# EAGLE design Moty Light (EAGLE 7.6.0)
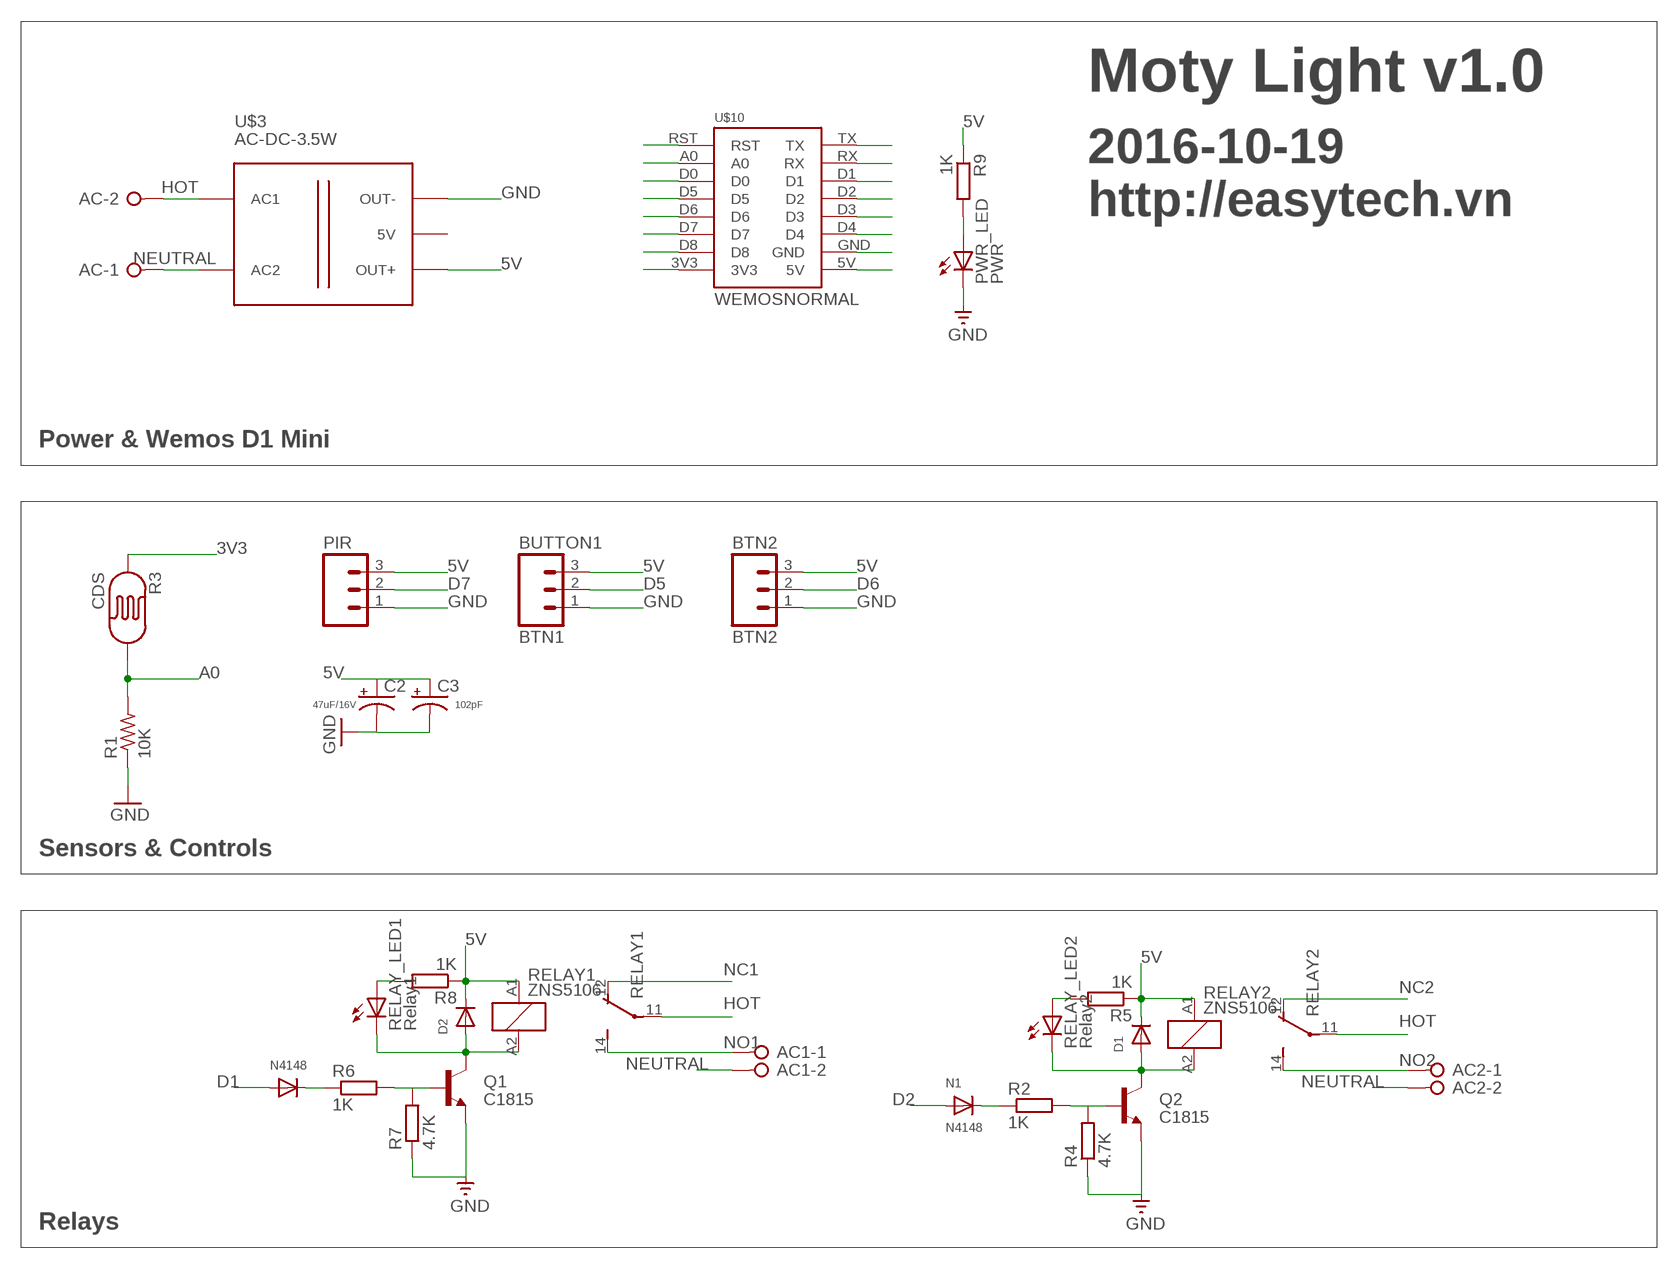
[diagram p0: schematic, sheet 1]

## Parts
AC  W237-02P  [W237-132]
AC1  W237-02P  [W237-132]
AC2  W237-02P  [W237-132]
BTN2  BTN2  M03PTH  [1X03]
BUTTON1  BTN1  M03PTH  [1X03]
C2  47uF/16V  CAP_POLPTH2  [CPOL-RADIAL-10UF-25V]
C3  102pF  CAP_POLPTH2  [CPOL-RADIAL-10UF-25V]
D1  DIODESMA  [SMADIODE]
D2  DIODESMA  [SMADIODE]
N1  N4148  DIODESOD-123  [SOD-123]
N4148  DIODESOD-123  [SOD-123]
PIR  M03PTH  [1X03]
PWR_LED  PWR  LED3MM  [LED3MM]
Q1  C1815  TRANSISTOR_NPNSOT23-3  [SOT23-3]
Q2  C1815  TRANSISTOR_NPNSOT23-3  [SOT23-3]
R1  10K  R-US_R0805  [R0805]
R2  1K  R-EU_R0805  [R0805]
R3  CDS  PHOTOCELL  [PHOTOCELL_THIN]
R4  4.7K  R-EU_R0805  [R0805]
R5  1K  R-EU_R0805  [R0805]
R6  1K  R-EU_R0805  [R0805]
R7  4.7K  R-EU_R0805  [R0805]
R8  1K  R-EU_R0805  [R0805]
R9  1K  R-EU_R0805  [R0805]
RELAY1  ZNS5106  [ZN5]
RELAY2  ZNS5106  [ZN5]
RELAY_LED1  Relay1  LED3MM  [LED3MM]
RELAY_LED2  Relay2  LED3MM  [LED3MM]
U$3  AC-DC-3.5W  [AC-DC-3.5W]
U$10  WEMOSNORMAL  [WEMOS]

## Nets
3V3: R3.1 U$10.3V3
5V: BTN2.3 BUTTON1.3 C2.1(+) C3.1(+) D1.C D2.C PIR.3 R5.1 R8.1 R9.1 RELAY1.A1 RELAY2.A1 U$3.J2.3(OUT+) U$10.5V
A0: R1.2 R3.2 U$10.A0
D0: U$10.D0
D1: N4148.A U$10.D1
D2: N1.A U$10.D2
D3: U$10.D3
D4: U$10.D4
D5: BUTTON1.2 U$10.D5
D6: BTN2.2 U$10.D6
D7: PIR.2 U$10.D7
D8: U$10.D8
GND: BTN2.1 BUTTON1.1 C2.2(-) C3.2(-) PIR.1 PWR_LED.K(C) Q1.2(E) Q2.2(E) R1.1 R4.1 R7.1 U$3.J2.1(OUT-) U$10.GND
HOT: AC.2 RELAY1.11(2:P) RELAY2.11(2:P) U$3.J1.1(AC1)
N$1: D2.A Q1.3(C) RELAY1.A2 RELAY_LED1.K(C)
N$3: N4148.C R6.1
N$4: R8.2 RELAY_LED1.A
N$5: D1.A Q2.3(C) RELAY2.A2 RELAY_LED2.K(C)
N$6: Q2.1(B) R2.2 R4.2
N$7: Q1.1(B) R6.2 R7.2
N$8: N1.C R2.1
N$9: R5.2 RELAY_LED2.A
N$10: PWR_LED.A R9.2
NC1: RELAY1.12(2:O)
NC2: RELAY2.12(2:O)
NEUTRAL: AC1.2 AC2.2 AC.1 U$3.J1.2(AC2)
NO1: AC1.1 RELAY1.14(2:S)
NO2: AC2.1 RELAY2.14(2:S)
RST: U$10.RST
RX: U$10.RX
TX: U$10.TX
Unconnected: U$3.J2.2(5V)

## Notes on the sheet
- Moty Light v1.0
- 2016-10-19
  http://easytech.vn
- Power & Wemos D1 Mini
- Sensors & Controls
- Relays

## Library data of the parts
AC AC1 AC2 = con-wago-508:W237-02P: WAGO SREW CLAMP; OC_FARNELL: unknown; OC_NEWARK: unknown
BTN2 BUTTON1 PIR = SparkFun-Connectors:M03: Header 3 Standard 3-pin 0.1" header. Use with straight break away headers (SKU : PRT-00116), right angle break away headers (PRT-00553), swiss pins (PRT-00743), machine pins (PRT-00117), and female headers (PRT-00115). Molex polarized connector foot print use with SKU : PRT-08232 with associated crimp pins and housings.
C2 C3 = SparkFun-Capacitors:CAP_POL: Capacitor Polarized These are standard SMD and PTH capacitors. Normally 10uF, 47uF, and 100uF in electrolytic and tantalum varieties. Always verify the external diameter of the through hole cap, it varies with capacity, voltage, and manufacturer. The EIA devices should be standard.
D1 D2 N1 N4148 = adafruit:DIODE: Diode SMADIODE - SMA Surface Mount Package 20V 1A Schottky Diode Digikey: 641-1014-6-ND DO-1N4148 - Through Hole Small Current Diode SOD-123 20V 1 A (.5mV Vf) Schottky Diode - Digikey: MBRX120TPMSCT-ND SOD-323 10V 570mA (.38mV Vf, 3ns) Schottky Diode - Digikey: ZLLS410CT-ND SOD-523 30V 30mA Schottky Diode (RB751S-40TE61) - Digikey: RB751S-40TE61CT-ND SOT23-R/W - SOT23 Package (R = Solder Paste/Reflow Ovens, W = Hand-Soldering) BAT54Film 40V 300mA - Digikey: 497-7162-1-ND
PWR_LED RELAY_LED1 RELAY_LED2 = adafruit:LED: LED OSRAM: - CHIPLED LG R971, LG N971, LY N971, LG Q971, LY Q971, LO R971, LY R971 LH N974, LH R974 LS Q976, LO Q976, LY Q976 LO Q996 - Hyper CHIPLED LW Q18S LB Q993, LB Q99A, LB R99A - SideLED LS A670, LO A670, LY A670, LG A670, LP A670 LB A673, LV A673, LT A673, LW A673 LH A674 LY A675 LS A676, LA A676, LO A676, LY A676, LW A676 LS A679, LY A679, LG A679 - Hyper Micro SIDELED® LS Y876, LA Y876, LO Y876, LY Y876 LT Y87S - SmartLED LW L88C, LW L88S LB L89C, LB L89S, LG L890 LS L89K, LO L89K, LY L89K LS L896, LA L896, LO L896, LY L896 - TOPLED LS T670, LO T670, LY T670, LG T670, LP T670 LSG T670, LSP T670, LSY T670, LOP T670, LYG T670 LG T671, LOG T671, LSG T671 LB T673, LV T673, LT T673, LW T673 LH T674 LS T676, LA T676, LO T676, LY T676, LB T676, LH T676, LSB T676, LW T676 LB T67C, LV T67C, LT T67C, LS T67K, LO T67K, LY T67K, LW E67C LS E67B, LA E67B, LO E67B, LY E67B, LB E67C, LV E67C, LT E67C LW T67C LS T679, LY T679, LG T679 LS T770, LO T770, LY T770, LG T770, LP T770 LB T773, LV T773, LT T773, LW T773 LH T774 LS E675, LA E675, LY E675, LS T675 LS T776, LA T776, LO T776, LY T776, LB T776 LHGB T686 LT T68C, LB T68C - Hyper Mini TOPLED® LB M676 - Mini TOPLED Santana® LG M470 LS M47K, LO M47K, LY M47K Source: http://www.osram.convergy.de/
Q1 Q2 = SparkFun-DiscreteSemi:TRANSISTOR_NPN: Generic NPN BJT MMBT2222A - TRANS-08049 (SOT-23, 1A 40V) MPSA42 - TRANS-09116 (SOT-23, 500mA 300V) MMBT5088LT1G - TRANS-11160 (SOT-23, 50 mA 30V) BC547 - COM-08928 <http://www.sparkfun.com/products/8928> (TO-92 45V 100mA) (1.Collector 2.Base 3.Emitter) 2N3904 - COM-00521 <http://www.sparkfun.com/products/521> (TO-92 40V 200mA) (1.Emitter 2.Base 3.Collector) P2N2222A - COM-12852 <http://www.sparkfun.com/products/12852> (TO-92 40V 600mA) (1.Collector 2.Base 3.Emitter); PROD_ID: TRANS-08049
R1 = rcl:R-US_: RESISTOR, American symbol
R2 R4-R9 = rcl:R-EU_: RESISTOR, European symbol
R3 = SparkFun-Sensors:PHOTOCELL: CdS photoresistor. This is a low cost way to detect light levels. Resistance decreases with more incoming light. SparkFun SKU: SEN-09088
RELAY1 RELAY2 = relay:ZNS5*: Miniature Power PCB Relay SCHRACK 1pole 10 A Source: http://www.schrack.com/.. 5847.pdf; OC_FARNELL: unknown; OC_NEWARK: unknown
U$3 = diy-modules:AC-DC-3.5W: AC/DC 3.5W Converter
U$10 = My Eagle Lib:WEMOS

## Board
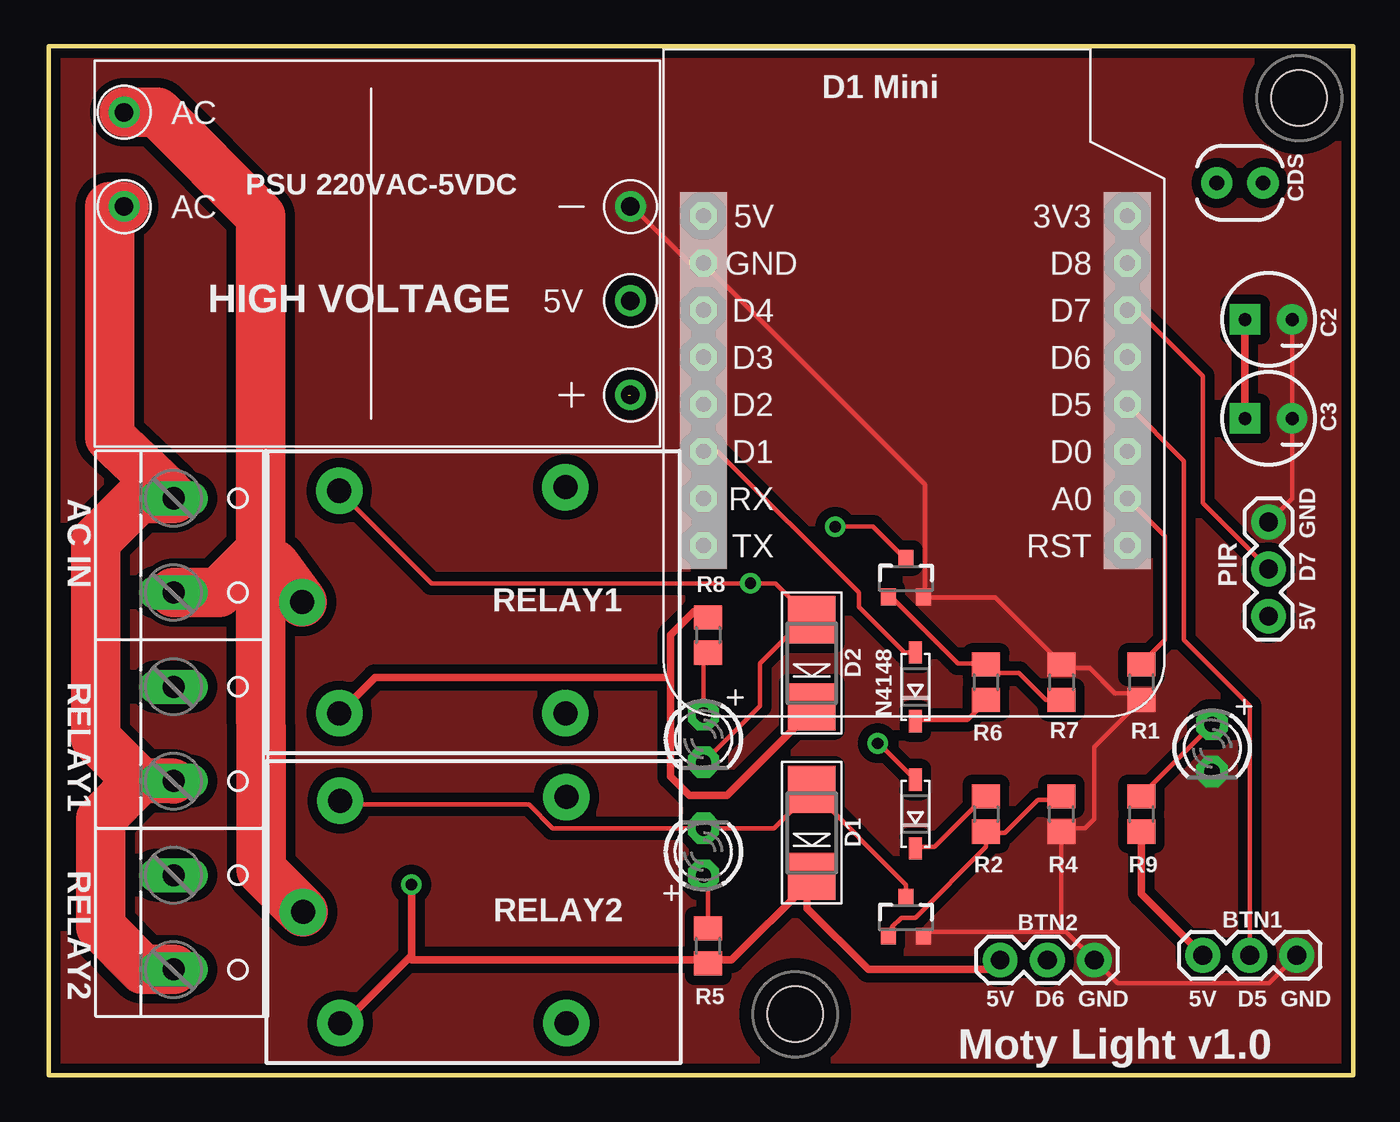
[diagram p1: board, top side]
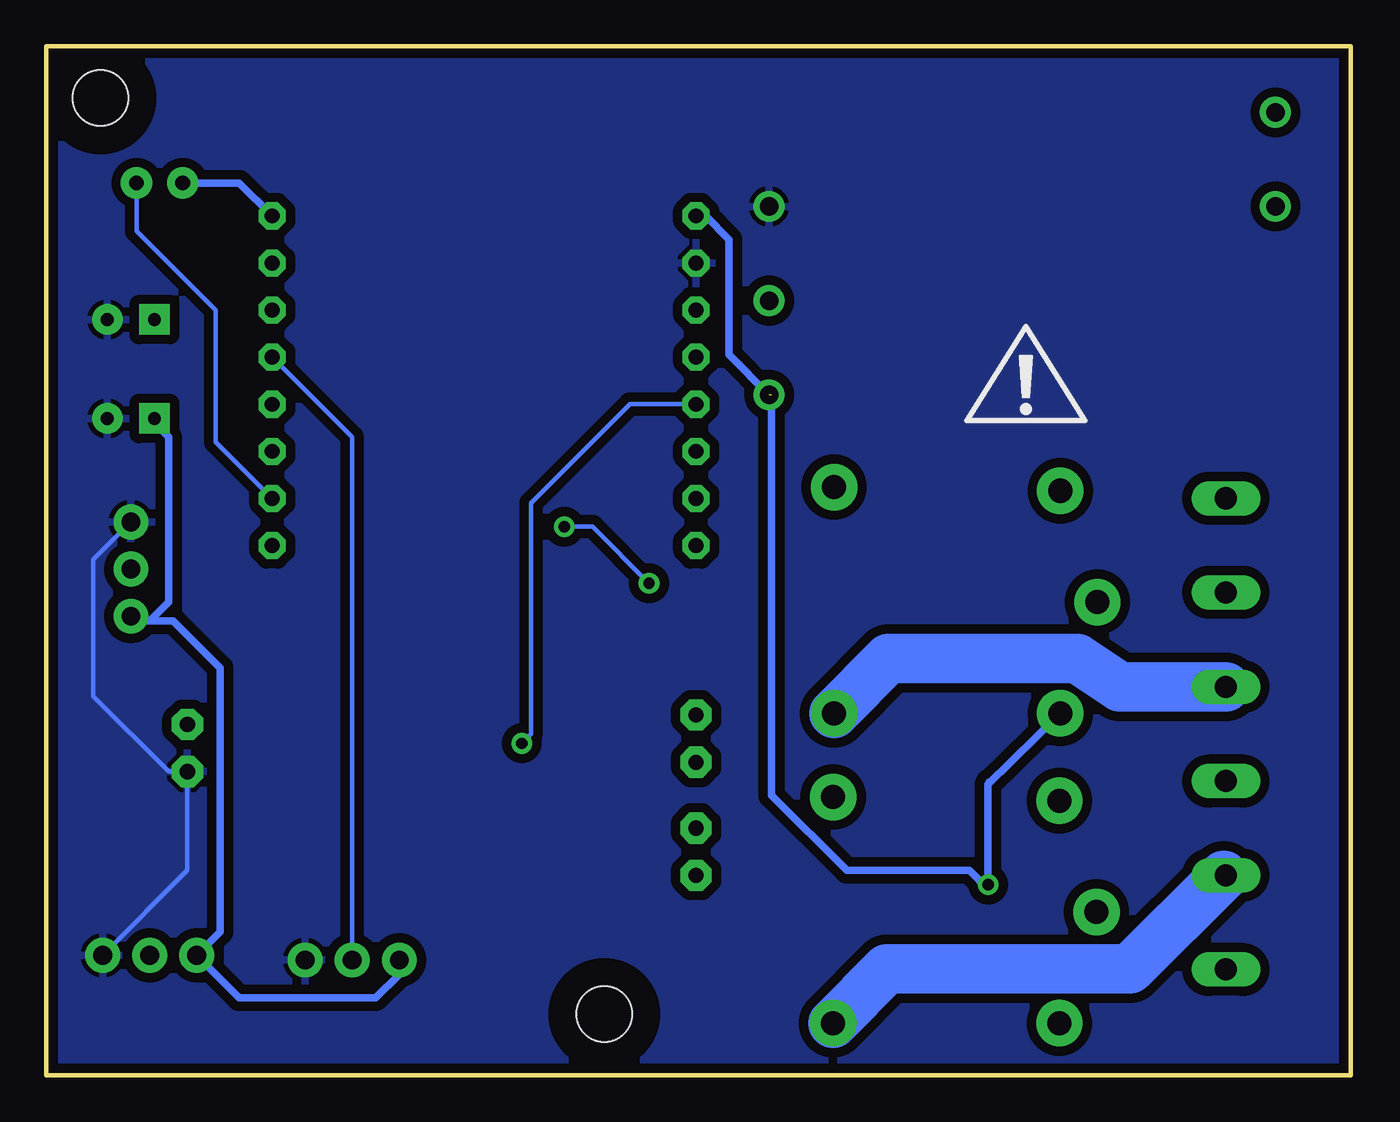
[diagram p2: board, bottom side, seen from below]

Size 70.35 x 55.5 mm. Coordinates in mm from the lower left corner, seen from the top.
Outline: 70.34,0 70.34,55.5 0,55.5 0,0 70.34,0
Copper layers (1*16): Top 0.035mm / dielectric 1.5mm / Bottom 0.035mm
Design rules "default *": minimum track width 10mil, minimum drill 24mil, track to track 10mil, track to pad 10mil, pad to pad 10mil, via to via 10mil, smd to smd 8mil, copper to edge 20mil, drill to drill 12mil, minimum pad ring 13mil, minimum via ring 10mil, stop-mask expansion 4mil, vias tented up to drill 0mil, thermal gap 10mil

### Footprints (pad centres in the part's own frame; a part is rotated, then mirrored left to right if it is on the bottom)
W237-132 = drill 1.194 long: 1 -2.54,-0.635; 2 2.54,-0.635
1X03 = drill 1.016 pad 1.88: 1 0,0; 2 2.54,0; 3 5.08,0
CPOL-RADIAL-10UF-25V = drill 0.7 pad 1.651 square: 1 1.27,0 | drill 0.7 pad 1.651: 2 -1.27,0
SMADIODE = smd 2.54 x 2.54: A 2.349,0; C -2.349,0
SOD-123 = smd 1.2 x 0.7: A 1.85,0; C -1.85,0
LED3MM = drill 0.813 pad 1.676 octagon: A -1.27,0; K 1.27,0
SOT23-3 = smd 0.8 x 0.9: 1 -0.95,-1; 2 0.95,-1; 3 0,1.1
R0805 = smd 1.3 x 1.5: 1 -0.95,0; 2 0.95,0
PHOTOCELL_THIN = drill 0.8 pad 1.676: 1 -1.15,0; 2 1.35,0
ZN5 = drill 1.3 pad 2.5: 11 8.89,0; 12 -5.31,-6.2; 14 -5.31,6; A1 6.89,6; A2 6.89,-6
AC-DC-3.5W = drill 1: J1.1 -13.335,7.62; J1.2 -13.335,2.54; J2.1 13.97,2.54; J2.2 13.97,-2.54; J2.3 13.97,-7.62
KFH-M3 = hole 3: 0,0
WEMOS = drill 0.8 octagon: 3V3 0,0; 5V 22.86,0; A0 0,15.24; D0 0,12.7; D1 22.86,12.7; D2 22.86,10.16; D3 22.86,7.62; D4 22.86,5.08; D5 0,10.16; D6 0,7.62; D7 0,5.08; D8 0,2.54; GND 22.86,2.54; RST 0,17.78; RX 22.86,15.24; TX 22.86,17.78

### Placement (x,y rotation side)
AC  7.37,28.59 270 top
AC1  7.37,18.41 270 top
AC2  7.37,8.25 270 top
BTN2  56.39,6.22 180 top
BUTTON1  67.31,6.48 180 top
C2  65.79,40.77 180 top
C3  65.79,35.43 180 top
D1  41.15,13.08 90 top
D2  41.15,22.23 90 top
N1  46.74,14.1 90 top
N4148  46.74,20.95 90 top
PIR  65.79,29.84 270 top
PWR_LED  62.74,17.65 270 top
Q1  46.23,26.8 0 top
Q2  46.23,8.51 0 top
R1  58.93,21.21 90 top
R2  50.55,14.1 270 top
R3  64.13,48.13 0 top
R4  54.61,14.1 90 top
R5  35.56,6.98 90 top
R6  50.55,21.21 90 top
R7  54.61,21.21 270 top
R8  35.56,23.75 270 top
R9  58.93,14.1 90 top
RELAY1  22.56,25.53 180 top
RELAY2  22.61,8.81 180 top
RELAY_LED1  35.31,18.16 270 top
RELAY_LED2  35.31,12.06 90 top
U$3  17.4,44.32 0 top
U$7  [KFH-M3]  40.26,3.3 0 top
U$8  [KFH-M3]  67.44,52.7 0 top
U$10  58.17,46.35 180 top
U$17  [ICON_EXL-S]  17.53,37.21 0 bottom

### Tracks (layer width: path | path; a pad name or v marks a point on that pad's centre or on a via)
3V3
  Bottom 0.406: U$10.3V3 59.94,48.13 R3.1
5V  (via drill 0.61)  (1 unrouted)
  Top 0.254: 19.56,6.22 19.43,6.35 | 35.56,6.22 R5.1 | 41.15,19.69 D2.C | 41.15,10.54 40.89,10.29 D1.C 41.15,10.54
  Top 0.406: RELAY2.A1 15.9,2.81 19.43,6.35 19.56,6.48 v19.56,10.29 | 33.53,21.46 33.53,16.13 34.54,15.11 36.58,15.11 41.15,19.69 | 33.53,21.46 33.53,23.75 34.8,25.02 35.56,25.02 R8.1 | 33.53,21.46 17.78,21.46 17.6,21.46 RELAY1.A1 | C2.1 C3.1 | R9.1 58.93,9.78 BUTTON1.3 | 19.56,6.22 35.56,6.22 36.83,6.22 40.89,10.29 40.89,9.02 44.2,5.71 50.8,5.71 BTN2.3
  Bottom 0.254: 19.56,15.87 19.56,15.69
  Bottom 0.406: RELAY1.A1 19.56,15.69 v19.56,10.29 19.56,10.03 20.57,11.05 27.18,11.05 31.24,15.11 31.24,36.7 | U$10.5V 34.8,46.35 33.53,45.09 33.53,38.86 U$3.J2.3 | BTN2.3 51.31,5.46 52.58,4.19 59.94,4.19 BUTTON1.3 60.96,7.75 60.96,21.97 63.5,24.51 64.77,24.51 | 64.77,24.51 63.75,25.53 63.75,34.42 64.52,35.18 C3.1 | 64.77,24.51 65.53,24.51 PIR.3
A0
  Top 0.254: U$10.A0 60.2,29.08 60.2,23.49 58.93,22.23 R1.2
  Bottom 0.254: U$10.A0 61.21,34.16 61.21,41.27 65.48,45.55 R3.2
D1
  Top 0.254: U$10.D1 36.07,33.66 43.69,26.03 43.69,25.27 46.16,22.8 N4148.A 46.74,22.99
D2  (via drill 0.61)
  Top 0.254: N1.A 44.78,17.91 v44.7,17.91
  Bottom 0.254: v44.7,17.91 44.2,18.41 44.2,30.86 38.86,36.2 U$10.D2
D5
  Top 0.254: BUTTON1.2 64.77,19.94 61.21,23.49 61.21,33.15 U$10.D5
D6
  Bottom 0.254: BTN2.2 53.85,34.42 U$10.D6
D7
  Top 0.254: PIR.2 62.23,30.86 62.23,37.72 58.67,41.27 U$10.D7
GND
  Top 0.254: C2.2 C3.2 67.06,31.11 PIR.1 | 54.61,7.75 54.86,7.75 BTN2.1 57.66,4.95 65.79,4.95 BUTTON1.1 | 54.61,7.75 47.24,7.75 Q2.2 | 54.61,7.75 R4.1 54.61,13.33 55.88,13.33 56.39,13.84 56.39,17.72 R1.1 58.58,20.61 | U$3.J2.1 31.5,46.86 34.54,43.81 U$10.GND 47.24,31.88 47.24,26.03 Q1.2 47.24,25.78 51.05,25.78 54.61,22.23 R7.1 54.8,21.97 56.13,21.97 57.5,20.61 58.58,20.61 | 58.58,20.61 58.49,20.7
  Bottom 0.254: BUTTON1.1 62.74,11.05 PWR_LED.K 63.75,16.38 67.82,20.45 67.82,27.81 PIR.1
  pour Bottom (isolate 0.508): -10.92,58.67 82.8,58.93 83.06,-4.19 -10.67,-4.45
  pour Top (isolate 0.508, no thermals): -10.92,58.67 82.8,58.93 83.06,-4.19 -10.67,-4.45
HOT
  Top 2.184: 11.43,28.32 12.19,27.56 11.43,26.8
  Top 2.667: U$3.J1.1 5.84,51.94 11.43,46.33 11.43,28.32 9.15,26.04 AC.2 | 12.19,27.56 RELAY1.11 | RELAY2.11 11.46,11.07 11.43,26.8
N$1  (via drill 0.61)
  Top 0.254: D2.A 41.15,24.26 | v42.42,29.59 44.45,29.59 46.14,27.9 Q1.3 | RELAY_LED1.K 38.35,19.94 38.35,22.23 40.7,24.57 D2.A | D2.A 39.18,26.54 v37.85,26.54 20.65,26.54 RELAY1.A2
  Bottom 0.254: v37.85,26.54 40.89,29.59 v42.42,29.59
N$3
  Top 0.254: N4148.C 46.74,19.18 49.53,19.18 50.55,20.19 R6.1
N$4
  Top 0.254: R8.2 35.31,23.05 RELAY_LED1.A
N$5
  Top 0.254: Q2.3 46.23,10.29 41.15,15.37 | 41.15,15.37 D1.A | RELAY2.A2 15.75,14.6 25.91,14.6 27.18,13.33 RELAY_LED2.K 39.12,13.33 41.15,15.37
N$6
  Top 0.254: R2.2 50.55,13.08 | 50.55,13.08 50.55,12.32 46.74,8.51 45.97,8.51 45.47,8 45.47,7.75 Q2.1 | 54.61,14.86 R4.2 54.42,14.86 53.34,14.86 51.56,13.08 50.55,13.08
N$7
  Top 0.254: 50.55,22.23 49.02,22.23 45.47,25.78 Q1.1 | 54.61,20.45 R7.2 53.78,20.26 52.32,21.72 51.05,21.72 50.55,22.23 | 50.55,22.23 R6.2
N$8
  Top 0.254: N1.C 46.74,12.32 47.75,12.32 50.55,15.11 R2.1
N$9
  Top 0.254: R5.2 35.56,10.29 RELAY_LED2.A
N$10
  Top 0.254: PWR_LED.A 58.93,15.11 R9.2
NEUTRAL
  Top 2.184: 6.35,31.51 AC.1
  Top 2.413: AC1.2 4.83,15.87
  Top 2.667: U$3.J1.2 3.3,46.86 3.3,34.42 6.35,31.51 | AC.1 4.84,31.12 2.54,28.83 2.54,18.16 4.83,15.87 2.79,13.84 2.79,8 5.08,5.71 AC2.2
NO1
  Bottom 2.667: AC1.1 12.45,20.95 14.73,22.48 24.94,22.48 RELAY1.14
NO2
  Bottom 2.184: AC2.1 6.86,10.79
  Bottom 2.667: 6.86,10.79 11.91,5.74 25.02,5.74 RELAY2.14

### Text on the board
tNames: PSU 220VAC-5VDC | CDS | HIGH VOLTAGE | AC IN | GND | D7 | 5V | RELAY1 | RELAY2 | 5V | D6 | GND | 5V | D5 | GND | Moty Light v1.0